# Altium schematic sheet Buttons.SchDoc: Mini Editor Keyboard
size A2; DrawnBy: Roman Sklyar; Organization: S-LAB; Address1: Russian Federation; Address2: Sergiev Posad; DocumentNumber: 6; Revision: v1.0; SheetNumber: 6; SheetTotal: 6
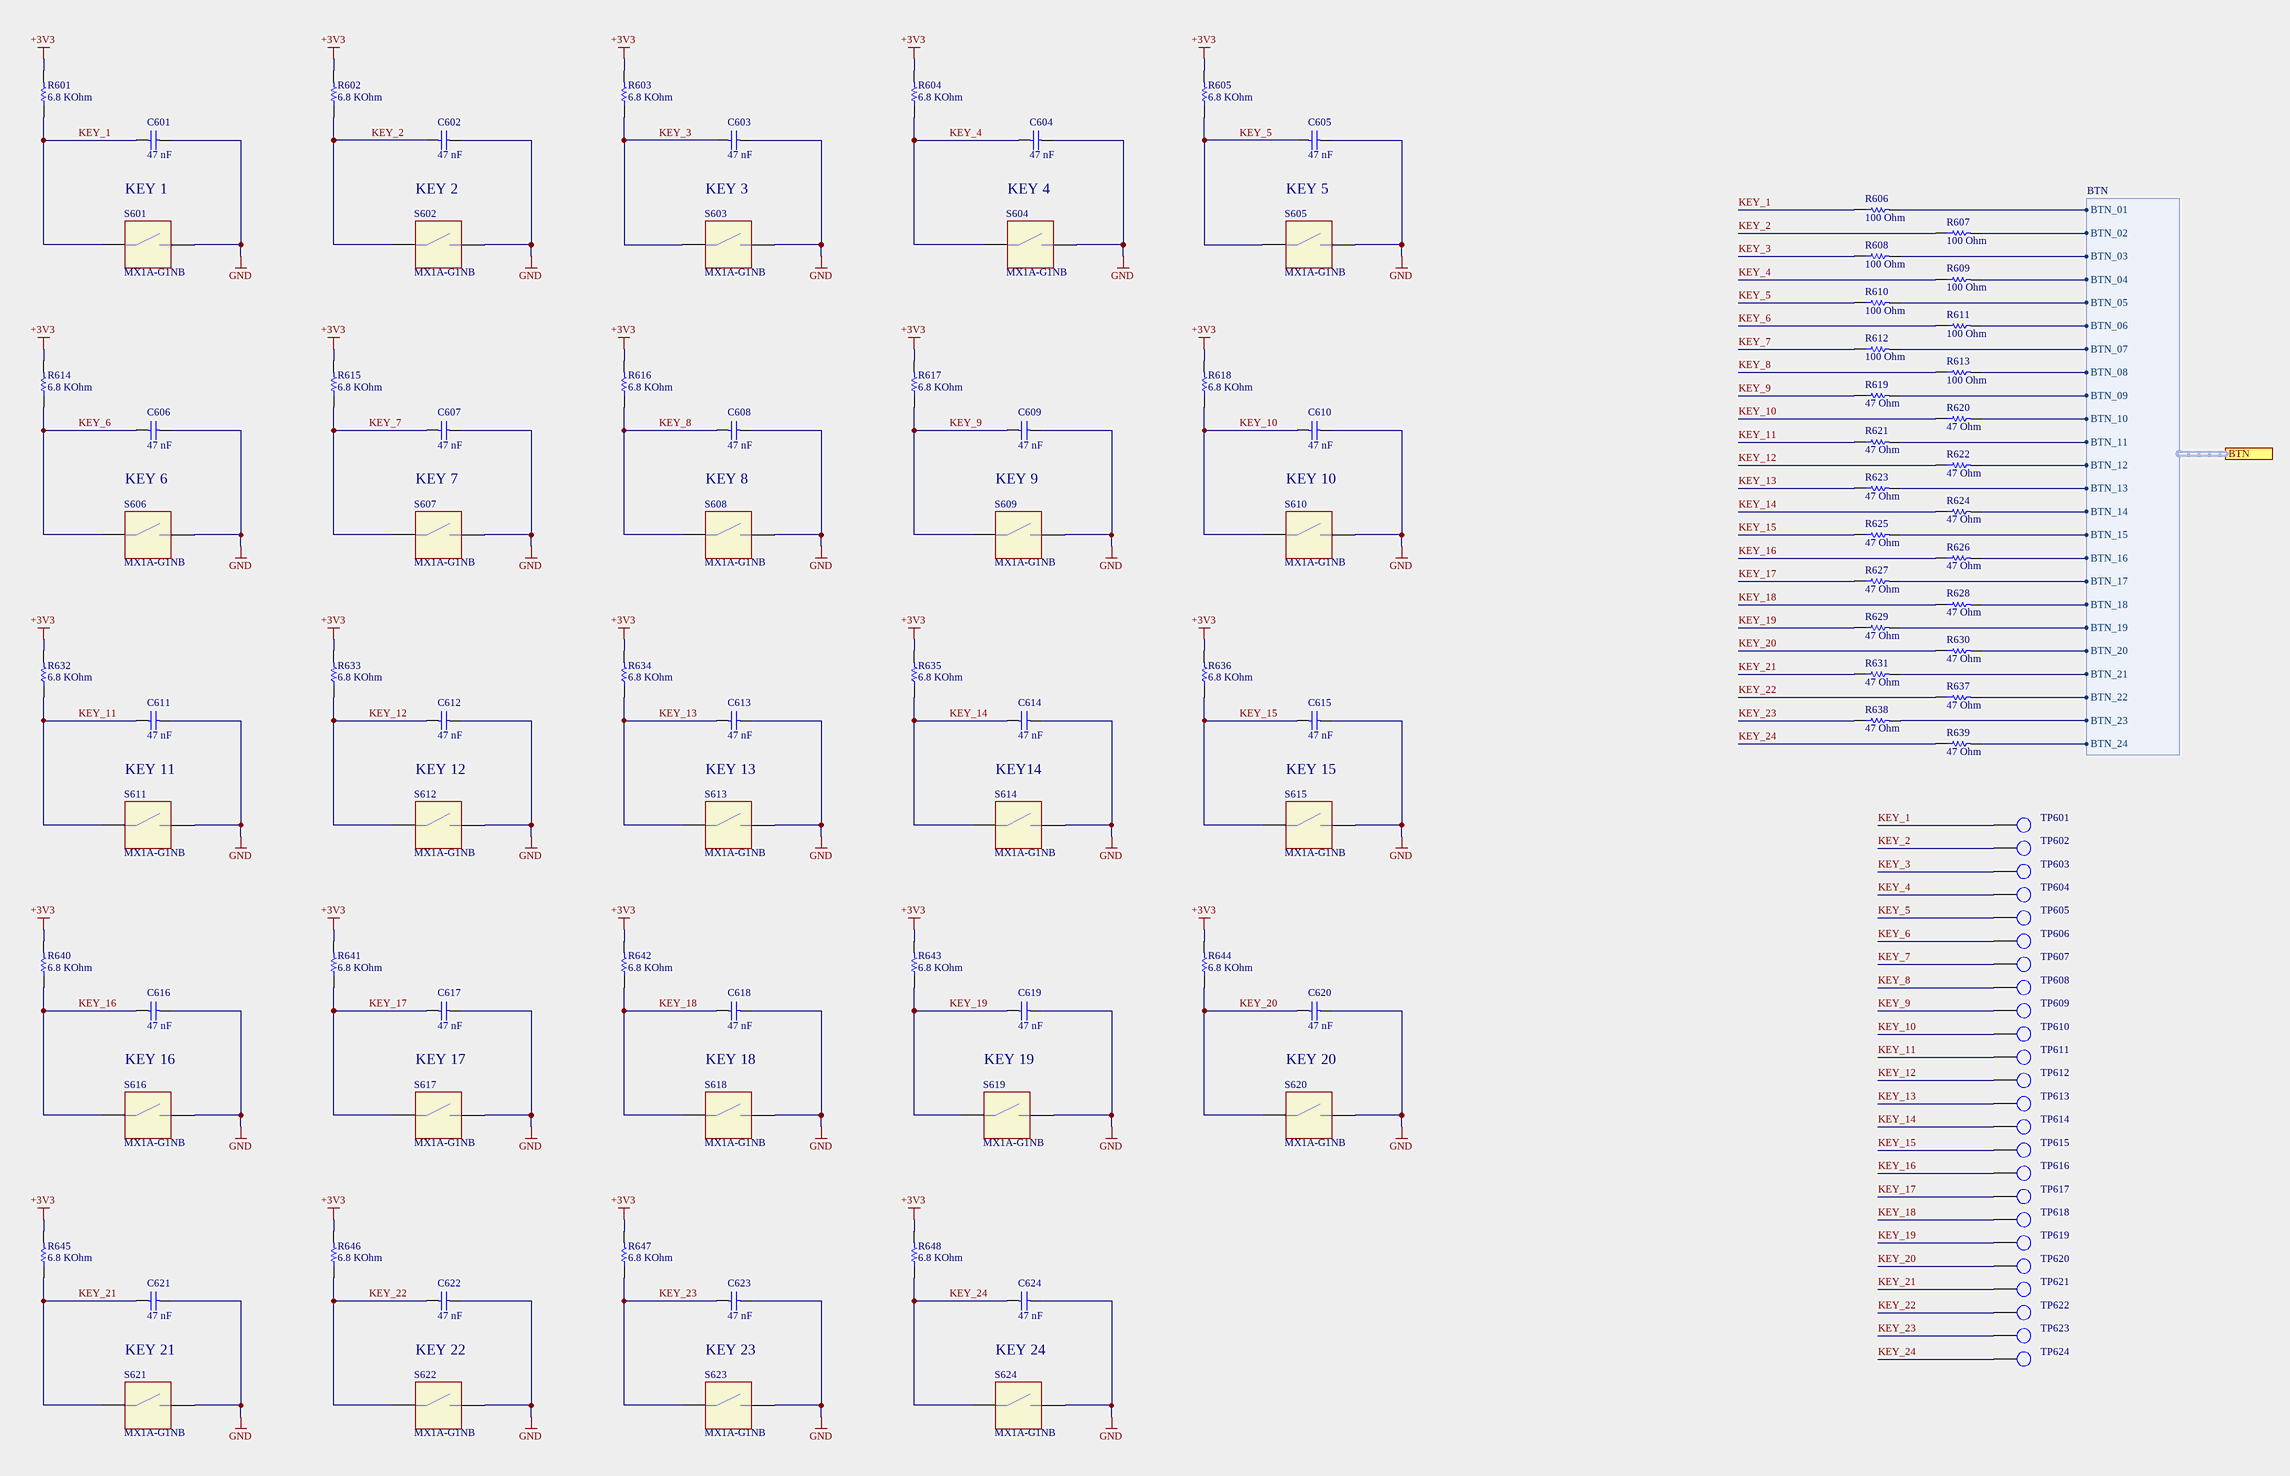
[diagram p0: Buttons.SchDoc]

## Parts
C601  Capacitance: 47 nF  [CAPC0603]  (hidden comment: CAP-47N)
C602  Capacitance: 47 nF  [CAPC0603]  (hidden comment: CAP-47N)
C603  Capacitance: 47 nF  [CAPC0603]  (hidden comment: CAP-47N)
C604  Capacitance: 47 nF  [CAPC0603]  (hidden comment: CAP-47N)
C605  Capacitance: 47 nF  [CAPC0603]  (hidden comment: CAP-47N)
C606  Capacitance: 47 nF  [CAPC0603]  (hidden comment: CAP-47N)
C607  Capacitance: 47 nF  [CAPC0603]  (hidden comment: CAP-47N)
C608  Capacitance: 47 nF  [CAPC0603]  (hidden comment: CAP-47N)
C609  Capacitance: 47 nF  [CAPC0603]  (hidden comment: CAP-47N)
C610  Capacitance: 47 nF  [CAPC0603]  (hidden comment: CAP-47N)
C611  Capacitance: 47 nF  [CAPC0603]  (hidden comment: CAP-47N)
C612  Capacitance: 47 nF  [CAPC0603]  (hidden comment: CAP-47N)
C613  Capacitance: 47 nF  [CAPC0603]  (hidden comment: CAP-47N)
C614  Capacitance: 47 nF  [CAPC0603]  (hidden comment: CAP-47N)
C615  Capacitance: 47 nF  [CAPC0603]  (hidden comment: CAP-47N)
C616  Capacitance: 47 nF  [CAPC0603]  (hidden comment: CAP-47N)
C617  Capacitance: 47 nF  [CAPC0603]  (hidden comment: CAP-47N)
C618  Capacitance: 47 nF  [CAPC0603]  (hidden comment: CAP-47N)
C619  Capacitance: 47 nF  [CAPC0603]  (hidden comment: CAP-47N)
C620  Capacitance: 47 nF  [CAPC0603]  (hidden comment: CAP-47N)
C621  Capacitance: 47 nF  [CAPC0603]  (hidden comment: CAP-47N)
C622  Capacitance: 47 nF  [CAPC0603]  (hidden comment: CAP-47N)
C623  Capacitance: 47 nF  [CAPC0603]  (hidden comment: CAP-47N)
C624  Capacitance: 47 nF  [CAPC0603]  (hidden comment: CAP-47N)
R601  Resistance: 6.8 KOhm  [RES0603]  (hidden comment: RES-6K8)
R602  Resistance: 6.8 KOhm  [RES0603]  (hidden comment: RES-6K8)
R603  Resistance: 6.8 KOhm  [RES0603]  (hidden comment: RES-6K8)
R604  Resistance: 6.8 KOhm  [RES0603]  (hidden comment: RES-6K8)
R605  Resistance: 6.8 KOhm  [RES0603]  (hidden comment: RES-6K8)
R606  Resistance: 100 Ohm  [RES0603]  (hidden comment: RES-100)
R607  Resistance: 100 Ohm  [RES0603]  (hidden comment: RES-100)
R608  Resistance: 100 Ohm  [RES0603]  (hidden comment: RES-100)
R609  Resistance: 100 Ohm  [RES0603]  (hidden comment: RES-100)
R610  Resistance: 100 Ohm  [RES0603]  (hidden comment: RES-100)
R611  Resistance: 100 Ohm  [RES0603]  (hidden comment: RES-100)
R612  Resistance: 100 Ohm  [RES0603]  (hidden comment: RES-100)
R613  Resistance: 100 Ohm  [RES0603]  (hidden comment: RES-100)
R614  Resistance: 6.8 KOhm  [RES0603]  (hidden comment: RES-6K8)
R615  Resistance: 6.8 KOhm  [RES0603]  (hidden comment: RES-6K8)
R616  Resistance: 6.8 KOhm  [RES0603]  (hidden comment: RES-6K8)
R617  Resistance: 6.8 KOhm  [RES0603]  (hidden comment: RES-6K8)
R618  Resistance: 6.8 KOhm  [RES0603]  (hidden comment: RES-6K8)
R619  Resistance: 47 Ohm  [RES0603]  (hidden comment: RES-47)
R620  Resistance: 47 Ohm  [RES0603]  (hidden comment: RES-47)
R621  Resistance: 47 Ohm  [RES0603]  (hidden comment: RES-47)
R622  Resistance: 47 Ohm  [RES0603]  (hidden comment: RES-47)
R623  Resistance: 47 Ohm  [RES0603]  (hidden comment: RES-47)
R624  Resistance: 47 Ohm  [RES0603]  (hidden comment: RES-47)
R625  Resistance: 47 Ohm  [RES0603]  (hidden comment: RES-47)
R626  Resistance: 47 Ohm  [RES0603]  (hidden comment: RES-47)
R627  Resistance: 47 Ohm  [RES0603]  (hidden comment: RES-47)
R628  Resistance: 47 Ohm  [RES0603]  (hidden comment: RES-47)
R629  Resistance: 47 Ohm  [RES0603]  (hidden comment: RES-47)
R630  Resistance: 47 Ohm  [RES0603]  (hidden comment: RES-47)
R631  Resistance: 47 Ohm  [RES0603]  (hidden comment: RES-47)
R632  Resistance: 6.8 KOhm  [RES0603]  (hidden comment: RES-6K8)
R633  Resistance: 6.8 KOhm  [RES0603]  (hidden comment: RES-6K8)
R634  Resistance: 6.8 KOhm  [RES0603]  (hidden comment: RES-6K8)
R635  Resistance: 6.8 KOhm  [RES0603]  (hidden comment: RES-6K8)
R636  Resistance: 6.8 KOhm  [RES0603]  (hidden comment: RES-6K8)
R637  Resistance: 47 Ohm  [RES0603]  (hidden comment: RES-47)
R638  Resistance: 47 Ohm  [RES0603]  (hidden comment: RES-47)
R639  Resistance: 47 Ohm  [RES0603]  (hidden comment: RES-47)
R640  Resistance: 6.8 KOhm  [RES0603]  (hidden comment: RES-6K8)
R641  Resistance: 6.8 KOhm  [RES0603]  (hidden comment: RES-6K8)
R642  Resistance: 6.8 KOhm  [RES0603]  (hidden comment: RES-6K8)
R643  Resistance: 6.8 KOhm  [RES0603]  (hidden comment: RES-6K8)
R644  Resistance: 6.8 KOhm  [RES0603]  (hidden comment: RES-6K8)
R645  Resistance: 6.8 KOhm  [RES0603]  (hidden comment: RES-6K8)
R646  Resistance: 6.8 KOhm  [RES0603]  (hidden comment: RES-6K8)
R647  Resistance: 6.8 KOhm  [RES0603]  (hidden comment: RES-6K8)
R648  Resistance: 6.8 KOhm  [RES0603]  (hidden comment: RES-6K8)
S601  KEY 1  [CHERRY MX PCB WITHOUT LED]
S602  KEY 2  [CHERRY MX PCB WITHOUT LED]
S603  KEY 3  [CHERRY MX PCB WITHOUT LED]
S604  KEY 4  [CHERRY MX PCB WITHOUT LED]
S605  KEY 5  [CHERRY MX PCB WITHOUT LED]
S606  KEY 6  [CHERRY MX PCB WITHOUT LED]
S607  KEY 7  [CHERRY MX PCB WITHOUT LED]
S608  KEY 8  [CHERRY MX PCB WITHOUT LED]
S609  KEY 9  [CHERRY MX PCB WITHOUT LED]
S610  KEY 10  [CHERRY MX PCB WITHOUT LED]
S611  KEY 11  [CHERRY MX PCB WITHOUT LED]
S612  KEY 12  [CHERRY MX PCB WITHOUT LED]
S613  KEY 13  [CHERRY MX PCB WITHOUT LED]
S614  KEY14  [CHERRY MX PCB WITHOUT LED]
S615  KEY 15  [CHERRY MX PCB WITHOUT LED]
S616  KEY 16  [CHERRY MX PCB WITHOUT LED]
S617  KEY 17  [CHERRY MX PCB WITHOUT LED]
S618  KEY 18  [CHERRY MX PCB WITHOUT LED]
S619  KEY 19  [CHERRY MX PCB WITHOUT LED]
S620  KEY 20  [CHERRY MX PCB WITHOUT LED]
S621  KEY 21  [CHERRY MX PCB WITHOUT LED]
S622  KEY 22  [CHERRY MX PCB WITHOUT LED]
S623  KEY 23  [CHERRY MX PCB WITHOUT LED]
S624  KEY 24  [CHERRY MX PCB WITHOUT LED]
TP601  (no value)  [TP_C-0.5mm]  (no BOM)
TP602  (no value)  [TP_C-0.5mm]  (no BOM)
TP603  (no value)  [TP_C-0.5mm]  (no BOM)
TP604  (no value)  [TP_C-0.5mm]  (no BOM)
TP605  (no value)  [TP_C-0.5mm]  (no BOM)
TP606  (no value)  [TP_C-0.5mm]  (no BOM)
TP607  (no value)  [TP_C-0.5mm]  (no BOM)
TP608  (no value)  [TP_C-0.5mm]  (no BOM)
TP609  (no value)  [TP_C-0.5mm]  (no BOM)
TP610  (no value)  [TP_C-0.5mm]  (no BOM)
TP611  (no value)  [TP_C-0.5mm]  (no BOM)
TP612  (no value)  [TP_C-0.5mm]  (no BOM)
TP613  (no value)  [TP_C-0.5mm]  (no BOM)
TP614  (no value)  [TP_C-0.5mm]  (no BOM)
TP615  (no value)  [TP_C-0.5mm]  (no BOM)
TP616  (no value)  [TP_C-0.5mm]  (no BOM)
TP617  (no value)  [TP_C-0.5mm]  (no BOM)
TP618  (no value)  [TP_C-0.5mm]  (no BOM)
TP619  (no value)  [TP_C-0.5mm]  (no BOM)
TP620  (no value)  [TP_C-0.5mm]  (no BOM)
TP621  (no value)  [TP_C-0.5mm]  (no BOM)
TP622  (no value)  [TP_C-0.5mm]  (no BOM)
TP623  (no value)  [TP_C-0.5mm]  (no BOM)
TP624  (no value)  [TP_C-0.5mm]  (no BOM)

## Ports
BTN (harness BTN)

## Harnesses
BTN: BTN_10, BTN_11, BTN_09, BTN_12, BTN_13, BTN_14, BTN_15, BTN_16, BTN_17, BTN_18, BTN_19, BTN_08, BTN_07, BTN_06, BTN_05, BTN_04, BTN_03, BTN_02, BTN_01, BTN_20, BTN_21, BTN_22, BTN_23, BTN_24

## Nets
+3V3: R601.2 R602.2 R603.2 R604.2 R605.2 R614.2 R615.2 R616.2 R617.2 R618.2 R632.2 R633.2 R634.2 R635.2 R636.2 R640.2 R641.2 R642.2 R643.2 R644.2 R645.2 R646.2 R647.2 R648.2
GND: C601.2 C602.2 C603.2 C604.2 C605.2 C606.2 C607.2 C608.2 C609.2 C610.2 C611.2 C612.2 C613.2 C614.2 C615.2 C616.2 C617.2 C618.2 C619.2 C620.2 C621.2 C622.2 C623.2 C624.2 S601.S2 S602.S2 S603.S2 S604.S2 S605.S2 S606.S2 S607.S2 S608.S2 S609.S2 S610.S2 S611.S2 S612.S2 S613.S2 S614.S2 S615.S2 S616.S2 S617.S2 S618.S2 S619.S2 S620.S2 S621.S2 S622.S2 S623.S2 S624.S2
KEY_1: C601.1 R601.1 R606.1 S601.S1 TP601.1
KEY_2: C602.1 R602.1 R607.1 S602.S1 TP602.1
KEY_3: C603.1 R603.1 R608.1 S603.S1 TP603.1
KEY_4: C604.1 R604.1 R609.1 S604.S1 TP604.1
KEY_5: C605.1 R605.1 R610.1 S605.S1 TP605.1
KEY_6: C606.1 R611.1 R614.1 S606.S1 TP606.1
KEY_7: C607.1 R612.1 R615.1 S607.S1 TP607.1
KEY_8: C608.1 R613.1 R616.1 S608.S1 TP608.1
KEY_9: C609.1 R617.1 R619.1 S609.S1 TP609.1
KEY_10: C610.1 R618.1 R620.1 S610.S1 TP610.1
KEY_11: C611.1 R621.1 R632.1 S611.S1 TP611.1
KEY_12: C612.1 R622.1 R633.1 S612.S1 TP612.1
KEY_13: C613.1 R623.1 R634.1 S613.S1 TP613.1
KEY_14: C614.1 R624.1 R635.1 S614.S1 TP614.1
KEY_15: C615.1 R625.1 R636.1 S615.S1 TP615.1
KEY_16: C616.1 R626.1 R640.1 S616.S1 TP616.1
KEY_17: C617.1 R627.1 R641.1 S617.S1 TP617.1
KEY_18: C618.1 R628.1 R642.1 S618.S1 TP618.1
KEY_19: C619.1 R629.1 R643.1 S619.S1 TP619.1
KEY_20: C620.1 R630.1 R644.1 S620.S1 TP620.1
KEY_21: C621.1 R631.1 R645.1 S621.S1 TP621.1
KEY_22: C622.1 R637.1 R646.1 S622.S1 TP622.1
KEY_23: C623.1 R638.1 R647.1 S623.S1 TP623.1
KEY_24: C624.1 R639.1 R648.1 S624.S1 TP624.1
NetR606_2: R606.2 ; port BTN.BTN_01
NetR607_2: R607.2 ; port BTN.BTN_02
NetR608_2: R608.2 ; port BTN.BTN_03
NetR609_2: R609.2 ; port BTN.BTN_04
NetR610_2: R610.2 ; port BTN.BTN_05
NetR611_2: R611.2 ; port BTN.BTN_06
NetR612_2: R612.2 ; port BTN.BTN_07
NetR613_2: R613.2 ; port BTN.BTN_08
NetR619_2: R619.2 ; port BTN.BTN_09
NetR620_2: R620.2 ; port BTN.BTN_10
NetR621_2: R621.2 ; port BTN.BTN_11
NetR622_2: R622.2 ; port BTN.BTN_12
NetR623_2: R623.2 ; port BTN.BTN_13
NetR624_2: R624.2 ; port BTN.BTN_14
NetR625_2: R625.2 ; port BTN.BTN_15
NetR626_2: R626.2 ; port BTN.BTN_16
NetR627_2: R627.2 ; port BTN.BTN_17
NetR628_2: R628.2 ; port BTN.BTN_18
NetR629_2: R629.2 ; port BTN.BTN_19
NetR630_2: R630.2 ; port BTN.BTN_20
NetR631_2: R631.2 ; port BTN.BTN_21
NetR637_2: R637.2 ; port BTN.BTN_22
NetR638_2: R638.2 ; port BTN.BTN_23
NetR639_2: R639.2 ; port BTN.BTN_24

## Notes on the sheet
- Title
- Size:
- Date:
- File:
- A2
- Number:
- Time:
- Revision:
- Sheet
- of

## Library data of the parts
C601-C624 = CAP-47N: Chip Capacitor, 47 nF, +/- 5%; Voltage Rating: 50 V; Mount: Surface Mount; Tolerance: 5 %; Type: Capacitor
R601-R605 R614-R618 R632-R636 R640-R648 = RES-6K8: Chip Resistor, 6.8 KOhm, +/- 1%; Voltage Rating: 50 V; Mount: Surface Mount; Tolerance: 1 %; Type: Resistor
R606-R613 = RES-100: Chip Resistor, 100 Ohm, +/- 1%; Voltage Rating: 50 V; Mount: Surface Mount; Tolerance: 1 %; Type: Resistor
R619-R631 R637-R639 = RES-47: Chip Resistor, 47 Ohm, +/- 1%; Voltage Rating: 50 V; Mount: Surface Mount; Tolerance: 1 %; Type: Resistor
S601-S624 = MX1A-G1NB: CHERRY MX Brown RGB Keyswitch 55cN; Type: Switch; Mount: Through Hole; Model: MX1A-G1NB
TP601-TP624 = TestPad